# Altium project RAD_V3_Signal_Conditioning.PrjPcb
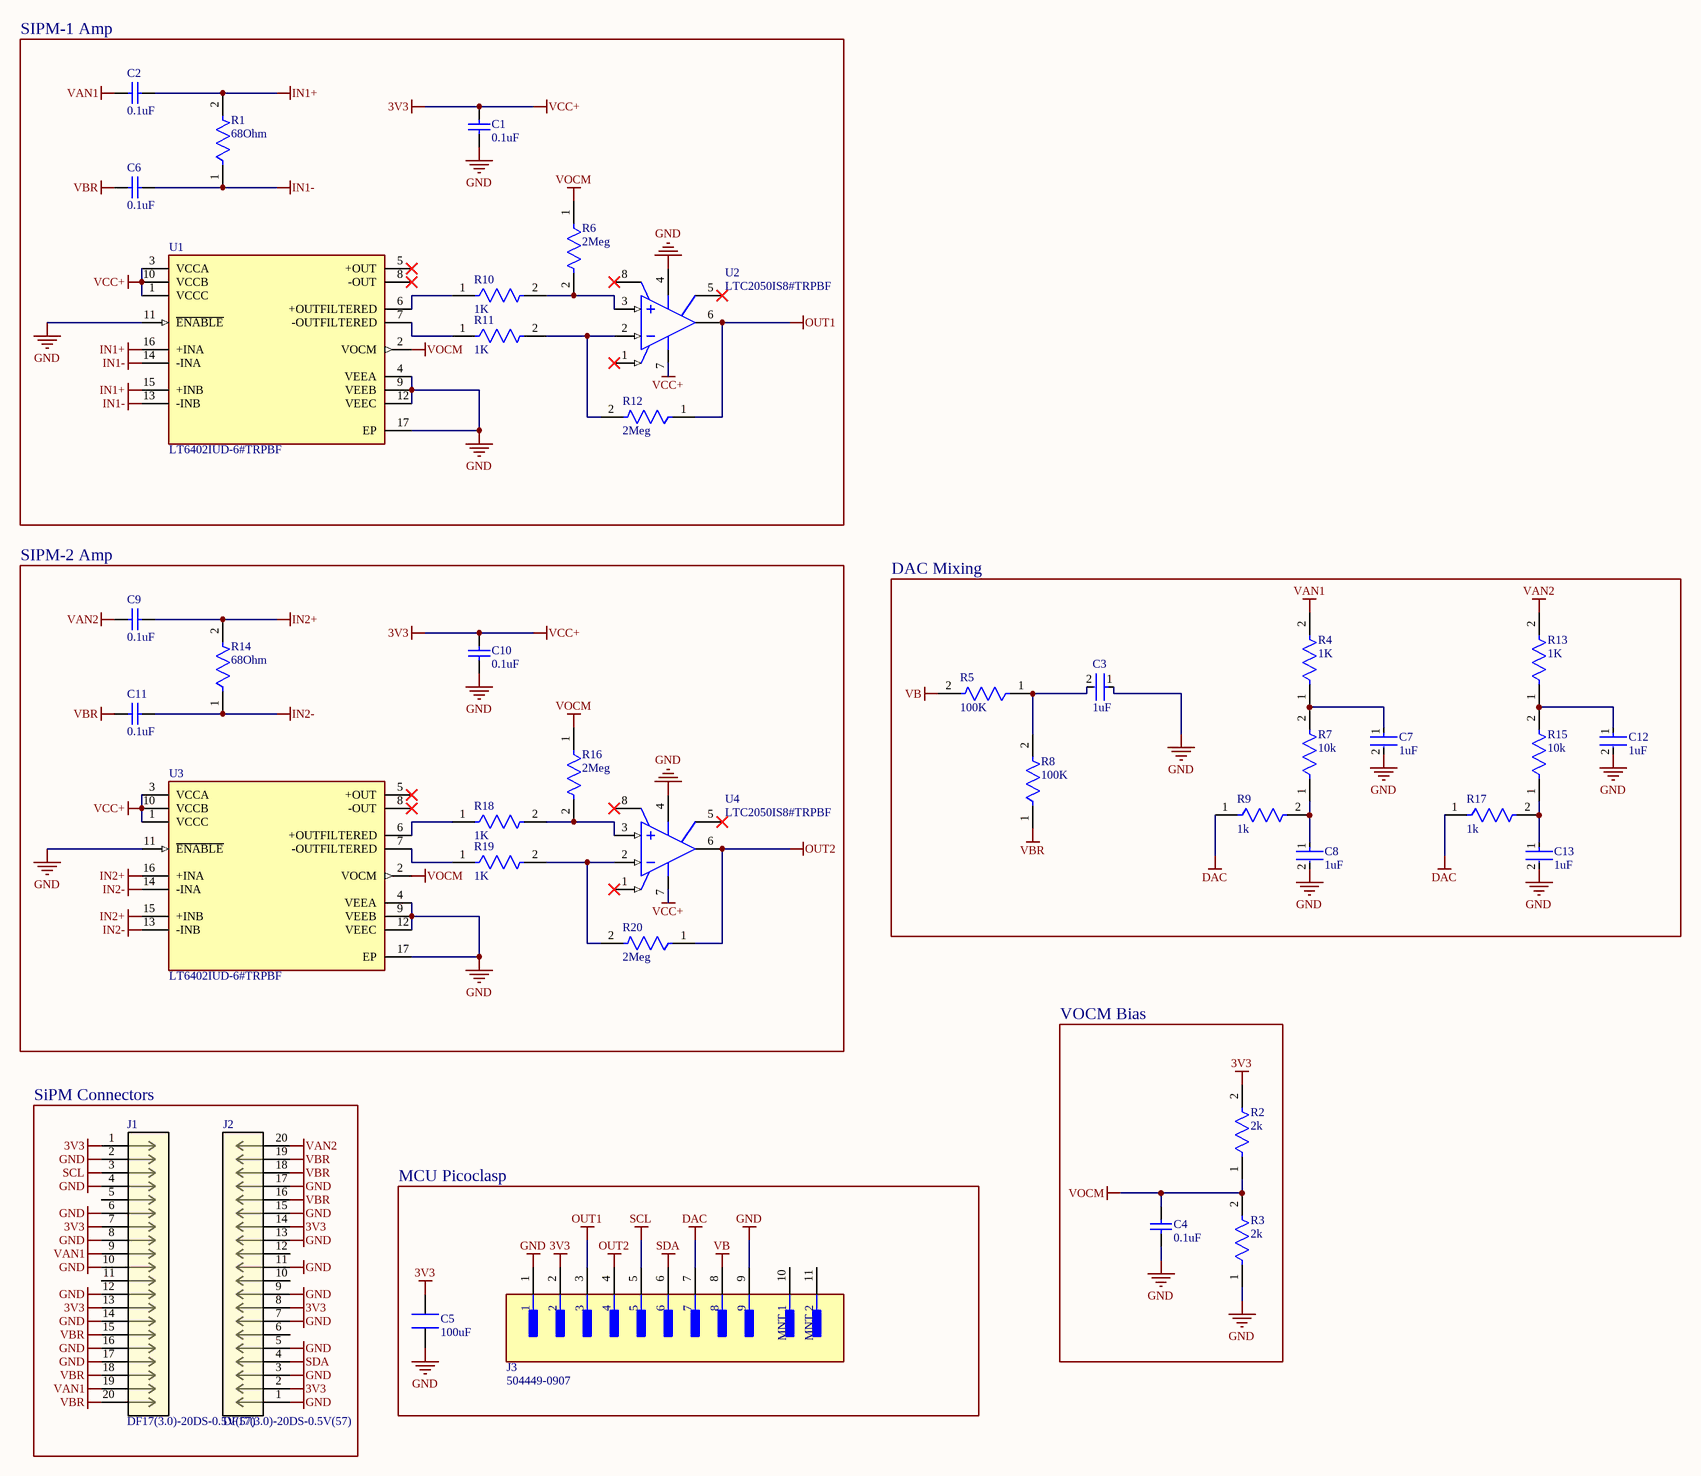
[diagram p0: RAD_V3_Signal_Conditioning.SchDoc]
1 sheet, 40 parts. Net scope: global (net labels, ports and power ports of the same name join across sheets).
Board file: RAD_V3_Signal_Conditioning.PcbDoc

## Sheet RAD_V3_Signal_Conditioning.SchDoc
size A2; SheetNumber: 1; SheetTotal: 1

### Parts
C1  0.1uF  [CAPC2013X145X50ML20T20]
C2  0.1uF  [CAPC2013X145X50ML20T20]
C3  1uF  [FP-CC0805-0_85-MFG]
C4  0.1uF  [CAPC2013X145X50ML20T20]
C5  100uF  [CAPACITOR_0805_2012M-70N]
C6  0.1uF  [CAPC2013X145X50ML20T20]
C7  1uF  [FP-CC0805-0_85-MFG]
C8  1uF  [FP-CC0805-0_85-MFG]
C9  0.1uF  [CAPC2013X145X50ML20T20]
C10  0.1uF  [CAPC2013X145X50ML20T20]
C11  0.1uF  [CAPC2013X145X50ML20T20]
C12  1uF  [FP-CC0805-0_85-MFG]
C13  1uF  [FP-CC0805-0_85-MFG]
J1  DF17(3.0)-20DS-0.5V(57)  [CONN_DF173.0-20DS-0.5V57_HIR]
J2  DF17(3.0)-20DS-0.5V(57)  [CONN_DF173.0-20DS-0.5V57_HIR]
J3  504449-0907  [FP-504449-0907-MFG]
R1  68Ohm  [FP-AC0805-MFG]
R2  2k  [FP-MCU0805-IPC_A]
R3  2k  [FP-MCU0805-IPC_A]
R4  1K  [FP-CRGCQ0805-IPC_C]
R5  100K  [FP-CRGCQ0805-IPC_C]
R6  2Meg  [FP-RK73H2A-IPC_A]
R7  10k  [FP-CRGCQ0805-IPC_C]
R8  100K  [FP-CRGCQ0805-IPC_C]
R9  1k  [FP-CRGCQ0805-IPC_C]
R10  1K  [FP-CRGCQ0805-IPC_C]
R11  1K  [FP-CRGCQ0805-IPC_C]
R12  2Meg  [FP-RK73H2A-IPC_A]
R13  1K  [FP-CRGCQ0805-IPC_C]
R14  68Ohm  [FP-AC0805-MFG]
R15  10k  [FP-CRGCQ0805-IPC_C]
R16  2Meg  [FP-RK73H2A-IPC_A]
R17  1k  [FP-CRGCQ0805-IPC_C]
R18  1K  [FP-CRGCQ0805-IPC_C]
R19  1K  [FP-CRGCQ0805-IPC_C]
R20  2Meg  [FP-RK73H2A-IPC_A]
U1  LT6402IUD-6#TRPBF  [FP-UD-16-05-08-1691-IPC_B]
U2  LTC2050IS8#TRPBF  [LT-S8-8_M]
U3  LT6402IUD-6#TRPBF  [FP-UD-16-05-08-1691-IPC_B]
U4  LTC2050IS8#TRPBF  [LT-S8-8_M]

### Blocks framed on the sheet
SIPM-1 Amp: C1 C2 C6 R1 R6 R10-R12 U1 U2
SIPM-2 Amp: C9-C11 R14 R16 R18-R20 U3 U4
DAC Mixing: C3 C7 C8 C12 C13 R4 R5 R7-R9 R13 R15 R17
VOCM Bias: C4 R2 R3
SiPM Connectors: J1 J2
MCU Picoclasp: C5 J3

### Nets
3V3: C1.2 C5.2 C10.2 J1.1 J1.7 J1.13 J2.2 J2.8 J2.14 J3.2 R2.2 U1.1(VCCC) U1.3(VCCA) U1.10(VCCB) U2.7(V+) U3.1(VCCC) U3.3(VCCA) U3.10(VCCB) U4.7(V+)  [also labelled VCC+]
DAC: J3.7 R9.1 R17.1
GND: C1.1 C3.1 C4.1 C5.1 C7.2 C8.2 C10.1 C12.2 C13.2 J1.2 J1.4 J1.6 J1.8 J1.10 J1.12 J1.14 J1.16 J1.17 J2.1 J2.3 J2.5 J2.7 J2.9 J2.11 J2.13 J2.15 J2.17 J3.1 J3.9 R3.1 U1.4(VEEA) U1.9(VEEB) U1.11(~{ENABLE}) U1.12(VEEC) U1.17(EP) U2.4(V-) U3.4(VEEA) U3.9(VEEB) U3.11(~{ENABLE}) U3.12(VEEC) U3.17(EP) U4.4(V-)
IN1+: C2.2 R1.2 U1.15(+INB) U1.16(+INA)
IN1-: C6.1 R1.1 U1.13(-INB) U1.14(-INA)
IN2+: C9.2 R14.2 U3.15(+INB) U3.16(+INA)
IN2-: C11.1 R14.1 U3.13(-INB) U3.14(-INA)
OUT1: J3.3 R12.1 U2.6(OUT)
OUT2: J3.4 R20.1 U4.6(OUT)
SCL: J1.3 J3.5
SDA: J2.4 J3.6
VAN1: C2.2 J1.9 J1.19 R4.2
VAN2: C9.2 J2.20 R13.2
VB: J3.8 R5.2
VBR: C6.2 C11.2 J1.15 J1.18 J1.20 J2.16 J2.18 J2.19 R8.1
VOCM: C4.2 R2.1 R3.2 R6.1 R16.1 U1.2(VOCM) U3.2(VOCM)
NetC3_2: C3.2 R5.1 R8.2
NetC7_1: C7.1 R4.1 R7.2
NetC8_1: C8.1 R7.1 R9.2
NetC12_1: C12.1 R13.1 R15.2
NetC13_1: C13.1 R15.1 R17.2
NetR6_2: R6.2 R10.2 U2.3(+IN)
NetR10_1: R10.1 U1.6(+OUTFILTERED)
NetR11_1: R11.1 U1.7(-OUTFILTERED)
NetR11_2: R11.2 R12.2 U2.2(-IN)
NetR16_2: R16.2 R18.2 U4.3(+IN)
NetR18_1: R18.1 U3.6(+OUTFILTERED)
NetR19_1: R19.1 U3.7(-OUTFILTERED)
NetR19_2: R19.2 R20.2 U4.2(-IN)

Not connected (* = marked no-connect by the designer): J1 5 11; J2 6 10 12; J3 10(MNT_1) 11(MNT_2); U1 5(+OUT)* 8(-OUT)*; U2 1(~{SHDN})* 5(NC)* 8(NC)*; U3 5(+OUT)* 8(-OUT)*; U4 1(~{SHDN})* 5(NC)* 8(NC)*

### Library data of the parts
C1 C2 C4 C6 C9-C11 = CMP-1036-04409-2: Manufacturer: Vitramon; Part Number: VJ0805Y104JXXCW1BC
C3 C7 C8 C12 C13 = CMP-03422-001015-1: CC0805 1 uF X7R 10.00% 50 V; Manufacturer Part Number: CC0805KFX7R9BB105; Manufacturer: Yageo; Material: Ceramic; Tolerance: 0.1; Voltage Rating: 50 V; Device Class L1: Passive Components; Ipc Land Pattern Name: CAPC200125X85; Temperature Range High: +85°C; ComponentLink2Description: Datasheet; Automotive: No; Temperature Range Low: -30°C; Height: 0.95mm; Device Class L2: Capacitors; Value: 1 uF; Octopart: https://octopart.com/cc0805kfx7r9bb105-yageo-76378930; Temperature Characteristic: X7R; Category: Cap; RoHS: TRUE; ComponentLink2URL: http://www.yageo.com/documents/recent/UPY-GPHC_Y5V_6.3V-to-50V_8.pdf; Package: CC0805-0.85; Footprint Url: http://www.yageo.com/exep/pages/download/literatures/UPY-C_GEN_24.pdf; Capacitance: 1 uF; Temperature: -30°C to +85°C; Lead Free: Yes; Mouser Description: Cap Ceramic 1uF 50VDC X7R 10% SMD 0805 125°C BP; Device Class L3: Ceramic Capacitors
C5 = GRM21BR60J107ME15L: Passive - Capacitor, 0805, 100uF Max, X5R, 6.3V ±20%, -55°C ~ 85°C, 0805 (2012 Metric). 20uF @ 6.3V; APSS Standard Part: APSS Standard; Tolerance: ±20%; Temperature Coefficient: X5R; Capacitance at Rated Voltage: 20%; Rated Voltage: 6.3V; Temp Range: -55°C ~ 85°C; Package: 0805; Supplier 1: Digikey; Supplier 1 Part No.: 490-GRM155R61E225KE11JCT-ND; MF Part No.: GRM21BR60J107ME15L; Value: 100uF
J1 J2 = DF173.0-20DS-0.5V57: Description; Manufacturer_Name: Hirose; Copyright: Copyright (C) 2025 Ultra Librarian. All rights reserved.; Manufacturer_Part_Number: DF17(3.0)-20DS-0.5V(57); RefDes: RefDes; Type: Type
J3 = CMP-00257-74601377-1: 504449-0907 Conn Shrouded Header (4 Sides) HDR 9 POS 1mm Solder ST SMD Pico-Clasp™ T/R; Manufacturer Lifecycle Status: ACTIVE; Plating: Gold; Number of Circuits: 9; Number of Pins: 9; NexarPartId: 74601377; RoHS: Compliant; Contact Plating: Gold; Orientation: Vertical; Country of Origin: JP; Number of Rows: 1; Lifecycle Status: Production
R1 R14 = CMP-03412-037099-1: RES SMD 68 OHM 5% 1/8W 0805; Manufacturer Part Number: AC0805JR-0768RL; Manufacturer: Yageo; Resistance: 68Ω; Voltage Rating: 150V; Automotive Grade: Grade 0; Tolerance: 0.05; Value: 68Ω; Composition: Thick Film; Digikey Description: RES SMD 68 OHM 5% 1/8W 0805; ComponentLink2Description: Datasheet; Octopart: https://octopart.com/ac0805jr-0768rl-yageo-30511008; Mouser Description: Thick Film Resistors - SMD 1/8W 68ohm 5% AEC-Q200; Category: Res; Temperature Range High: +155°C; Series: AC; Height: 0.6mm; Device Class L2: Resistors; Lead Free: Yes; Footprint Url: http://www.yageo.com/exep/pages/download/literatures/PYu-R_Mount_10.pdf; RoHS: TRUE; Device Class L1: Passive Components; Power Rating: 1/8W; Automotive: Yes; Temperature Range Low: -55°C; Package: AC0805; ComponentLink2URL: http://www.yageo.com/documents/recent/PYu-AC_51_RoHS_L_6.pdf; Ipc Land Pattern Name: RESC200125X50; Temperature: -55°C to +155°C; Device Class L3: Chip SMD Resistors
R2 R3 = CMP-02407-000077-1: RES 1.05K OHM 0.5% 1/5W 0805; Tolerance: 0.1%; Max Power Dissipation: 125mW; Temperature Coefficient: 25ppm/°C; Resistance: 2kR; Package Quantity: 5000; Min Operating Temperature: -55°C; Radiation Hardening: No; Number of Terminations: 2; Width: 0.049inch; Max Operating Temperature: 125°C; Lead Free: Lead Free; Case/Package: 0805; Length: 0.079inch; Composition: Thin Film; Packaging: Tape and Reel; Contact Plating: Tin; Height: 0.022inch; Depth: 1.25mm; Military Standard: Not
R4 R9-R11 R13 R17-R19 = CMP-03211-004613-1: CRGCQ 0805 1K0 1%; Manufacturer: TE Connectivity; Manufacturer Part Number: CRGCQ0805F1K0; Value: 1KΩ; Power Rating: 0.125W; Description: CRGCQ0805 1KΩ 0.125W ±100ppm/°C 1% 150V; Temperature Coefficient: ±100ppm/°C; Tolerance: 0.01; Automotive Grade: Grade 685; Voltage Rating: 150V; Digikey Description: CRGCQ 0805 1K0 1%; Octopart: https://octopart.com/crgcq0805f1k0-te+connectivity-91018154; ComponentLink2Description: Datasheet; Ipc Land Pattern Name: RESC200125X55; Device Class L2: Resistors; Device Class L1: Passive Components; Category: Res; Device Class L3: Chip SMD Resistors; Temperature Range Low: -55°C; Temperature Range High: +155°C; Automotive: Yes; Height: 0.65mm; Resistance: 1KΩ; ComponentLink2URL: https://www.te.com/commerce/DocumentDelivery/DDEController?Action=showdoc&DocId=Data+Sheet%7F1773204-3%7F1%7Fpdf%7FEnglish%7FENG_DS_1773204-3_1.pdf%7F4-2176341-694; Series: CRGCQ; Temperature: -55°C to +155°C; Composition: Thick Film; Lead Free: Yes; RoHS: TRUE; Ambient Temperature Range High: +70°C; Package: CRGCQ0805
R5 R8 = CMP-03211-000816-1: CRGCQ 0805 100K 1%; Manufacturer: TE Connectivity; Manufacturer Part Number: CRGCQ0805F100K; Tolerance: 0.01; Power Rating: 0.125W; Resistance: 100KΩ; Value: 100KΩ; Temperature Coefficient: ±100ppm/°C; Voltage Rating: 150V; Description: CRGCQ0805 100KΩ 0.125W ±100ppm/°C 1% 150V; RoHS: TRUE; ComponentLink2URL: https://www.te.com/commerce/DocumentDelivery/DDEController?Action=showdoc&DocId=Data+Sheet%7F1773204-3%7F1%7Fpdf%7FEnglish%7FENG_DS_1773204-3_1.pdf%7F4-2176341-1150; Category: Res; Device Class L2: Resistors; Height: 0.65mm; Ambient Temperature Range High: +70°C; Ipc Land Pattern Name: RESC200125X55; Octopart: https://octopart.com/crgcq0805f100k-te+connectivity-91018138; Digikey Description: CRGCQ 0805 100K 1%; Temperature Range High: +155°C; Lead Free: Yes; Automotive: Yes; Temperature Range Low: -55°C; Device Class L1: Passive Components; Device Class L3: Chip SMD Resistors; Mouser Description: Res Thick Film 0805 100K Ohm 1% 0.125W(1/8W) ±100ppm/C Pad SMD Automotive T/R; Temperature: -55°C to +155°C; Composition: Thick Film; ComponentLink2Description: Datasheet; Automotive Grade: Grade 1141; Package: CRGCQ0805; Series: CRGCQ
R6 R12 R16 R20 = CMP-04015-092522-1: 2MΩ ±1% 0.25W Chip Resistor 0805 Flat Chip (Anti-Sulfuration) AEC-Q200 Qualified; Temperature Coefficient: 200ppm/°C; Resistance: 2MR; Voltage Rating: 150V; Power Rating: 125mW; Width: 1.2mm; Termination: SMD/SMT; Height: 0.5mm; Length: 2mm; RoHS Compliant: Yes; Packaging: Tape and Reel; Case/Package: 0805; Max Operating Temperature: 155°C; Min Operating Temperature: -55°C; Tolerance: 1%; Package Quantity: 5000; Weight: 0.000194oz; Case Code (Metric): 2012; Case Code (Imperial): 0805
R7 R15 = CMP-03211-002989-1: CRGCQ 0805 10K 5%; Manufacturer Part Number: CRGCQ0805J10K; Manufacturer: TE Connectivity; Voltage Rating: 150V; Temperature Coefficient: ±100ppm/°C; Resistance: 10KΩ; Description: CRGCQ0805 10KΩ 0.125W ±100ppm/°C 5% 150V; Value: 10KΩ; Power Rating: 0.125W; Tolerance: 0.05; Automotive Grade: Grade 914; Height: 0.65mm; Lead Free: Yes; Temperature Range High: +155°C; Composition: Thick Film; Temperature Range Low: -55°C; Ambient Temperature Range High: +70°C; Temperature: -55°C to +155°C; Package: CRGCQ0805; Device Class L2: Resistors; RoHS: TRUE; ComponentLink2URL: https://www.te.com/commerce/DocumentDelivery/DDEController?Action=showdoc&DocId=Data+Sheet%7F1773204-3%7F1%7Fpdf%7FEnglish%7FENG_DS_1773204-3_1.pdf%7F4-2176341-923; Series: CRGCQ; Device Class L1: Passive Components; Ipc Land Pattern Name: RESC200125X55; ComponentLink2Description: Datasheet; Category: Res; Digikey Description: CRGCQ 0805 10K 5%; Mouser Description: Res Thick Film 0805 10K Ohm 5% 0.125W(1/8W) ±100ppm/C Pad SMD Automotive T/R; Automotive: Yes; Octopart: https://octopart.com/crgcq0805j10k-te+connectivity-91018201; Device Class L3: Chip SMD Resistors
U1 U3 = CMP-0359-03805-3: IC OPAMP DIFF 2 CIRCUIT 16QFN; Common Mode Rejection Ratio: 42dB; Operating Supply Voltage: 5V; Bandwidth: 300MHz; Output Current per Channel: 35mA; Max Supply Voltage: 5.5V; Min Supply Voltage: 4V; Slew Rate: 400V/µs; Number of Elements: 1; Amplifier Type: DIFFERENTIAL; Power Supply Rejection Ratio (PSRR): 55dB; Input Bias Current: 5uA; Number of Circuits: 2; Input Resistance: 240R; Input Offset Voltage (Vos): 6.5mV; Operating Supply Current: 30mA; -3db Bandwidth: 300MHz; Number of Channels: 1; Package Quantity: 2500; Max Operating Temperature: 85°C; Min Operating Temperature: -40°C; Nominal Gain Bandwidth Product: 300MHz; Series: -; Packaging: Tape and Reel; Case/Package: QFN EP; RoHS Compliant: Yes; Number of Pins: 16
U2 U4 = CMP-0359-03382-2: Single Channel, Zero-Drift Operational Amplifier, 3 MHz Typical GBW, 2 V/us Typical SR, 2.7 to 6 V, 8-Pin SOIC (S8-8), Industrial, Pb-Free, Reel; Manufacturer: Linear Technology; Vos (mV) Typical: 0.0005; SR (V/us) Typical: 2; GBW (MHz) Typical: 3; Channels (#): 1; Is (mA) Typical: 0.8; Vs Max (V): 6; Vs Min (V): 2.7; RoHS: Pb-Free; ComponentLink1URL: http://www.linear.com/; Mounting Technology: Surface Mount; PartNumber: LTC2050IS8#TRPBF; ComponentLink3URL: http://cds.linear.com/docs/en/packaging/05081610_G_SO8.pdf; PackageDescription: 8-Pin Plastic Small Outline, Body 4.9 x 3.9 mm, Pitch 1.27 mm; PackageReference: LT-S8-8; Type: ZD; Linear Technology Part Number: LTC2050; ComponentLink1Description: Manufacturer URL; PackageVersion: Rev G; ComponentLink2Description: Datasheet; Packing: Reel; ComponentLink3Description: Package Specification; RevisionNote: URLs updated; DatasheetVersion: Rev C; ComponentLink2URL: http://cds.linear.com/docs/en/datasheet/2050fc.pdf